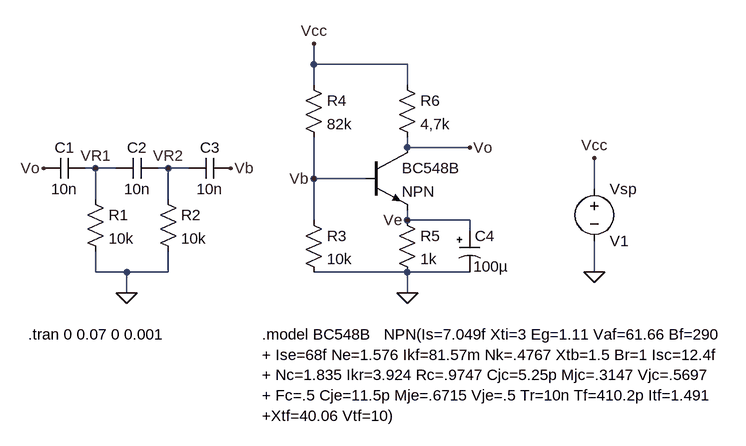
[diagram p0: schematic parteD.asc]
parteD.asc, the LTspice schematic file:
Version 4
SHEET 1 880 680
WIRE 96 0 96 -32
WIRE 240 0 96 0
WIRE 96 32 96 0
WIRE 240 32 240 0
WIRE 240 128 240 112
WIRE 336 128 240 128
WIRE -240 160 -256 160
WIRE -208 160 -240 160
WIRE -128 160 -144 160
WIRE -96 160 -128 160
WIRE 96 176 96 112
WIRE 176 176 96 176
WIRE 528 192 528 144
WIRE -240 208 -240 160
WIRE -128 208 -128 160
WIRE 96 240 96 176
WIRE 240 240 240 224
WIRE 336 240 240 240
WIRE 336 256 336 240
WIRE -240 320 -240 288
WIRE -192 320 -240 320
WIRE -128 320 -128 288
WIRE -128 320 -192 320
WIRE 240 320 96 320
WIRE 336 320 240 320
WIRE 528 320 528 272
WIRE -192 352 -192 320
WIRE 240 352 240 320
FLAG 240 352 0
FLAG 96 -32 Vcc
FLAG 528 320 0
FLAG 528 144 Vcc
FLAG -32 160 Vb
FLAG 96 176 Vb
FLAG -192 352 0
FLAG -320 160 Vo
FLAG 336 128 Vo
FLAG -240 160 VR1
FLAG -128 160 VR2
FLAG 240 240 Ve
SYMBOL npn 176 128 R0
SYMATTR InstName BC548B
SYMBOL cap -256 144 R90
WINDOW 0 0 32 VBottom 2
WINDOW 3 32 32 VTop 2
SYMATTR InstName C1
SYMATTR Value 10n
SYMBOL cap -144 144 R90
WINDOW 0 0 32 VBottom 2
WINDOW 3 32 32 VTop 2
SYMATTR InstName C2
SYMATTR Value 10n
SYMBOL cap -32 144 R90
WINDOW 0 0 32 VBottom 2
WINDOW 3 32 32 VTop 2
SYMATTR InstName C3
SYMATTR Value 10n
SYMBOL res -256 192 R0
SYMATTR InstName R1
SYMATTR Value 10k
SYMBOL res -144 192 R0
SYMATTR InstName R2
SYMATTR Value 10k
SYMBOL polcap 320 256 R0
WINDOW 3 22 55 Left 2
SYMATTR Value 100µ
SYMATTR InstName C4
SYMBOL res 224 224 R0
SYMATTR InstName R5
SYMATTR Value 1k
SYMBOL res 80 224 R0
SYMATTR InstName R3
SYMATTR Value 10k
SYMBOL res 80 16 R0
SYMATTR InstName R4
SYMATTR Value 82k
SYMBOL res 224 16 R0
SYMATTR InstName R6
SYMATTR Value 4,7k
SYMBOL voltage 528 176 R0
WINDOW 123 0 0 Left 2
WINDOW 39 0 0 Left 2
SYMATTR InstName Vsp
SYMATTR Value V1
TEXT -344 416 Left 2 !.tran 0 0.07 0 0.001
TEXT 16 416 Left 2 !.model BC548B   NPN(Is=7.049f Xti=3 Eg=1.11 Vaf=61.66 Bf=290\n+ Ise=68f Ne=1.576 Ikf=81.57m Nk=.4767 Xtb=1.5 Br=1 Isc=12.4f \n+ Nc=1.835 Ikr=3.924 Rc=.9747 Cjc=5.25p Mjc=.3147 Vjc=.5697 \n+ Fc=.5 Cje=11.5p Mje=.6715 Vje=.5 Tr=10n Tf=410.2p Itf=1.491 \n+Xtf=40.06 Vtf=10)

The netlist it stands for:
* parteD.asc
Q§BC548B Vo Vb Ve 0 NPN
C1 VR1 Vo 10n
C2 VR2 VR1 10n
C3 Vb VR2 10n
R1 VR1 0 10k
R2 VR2 0 10k
C4 Ve 0 100µ
R5 Ve 0 1k
R3 Vb 0 10k
R4 Vcc Vb 82k
R6 Vcc Vo 4,7k
Vsp Vcc 0 V1
.model NPN NPN
.model PNP PNP
.lib standard.bjt
.tran 0 0.07 0 0.001
.model BC548B   NPN(Is=7.049f Xti=3 Eg=1.11 Vaf=61.66 Bf=290
+ Ise=68f Ne=1.576 Ikf=81.57m Nk=.4767 Xtb=1.5 Br=1 Isc=12.4f
+ Nc=1.835 Ikr=3.924 Rc=.9747 Cjc=5.25p Mjc=.3147 Vjc=.5697
+ Fc=.5 Cje=11.5p Mje=.6715 Vje=.5 Tr=10n Tf=410.2p Itf=1.491
+Xtf=40.06 Vtf=10)
.backanno
.end